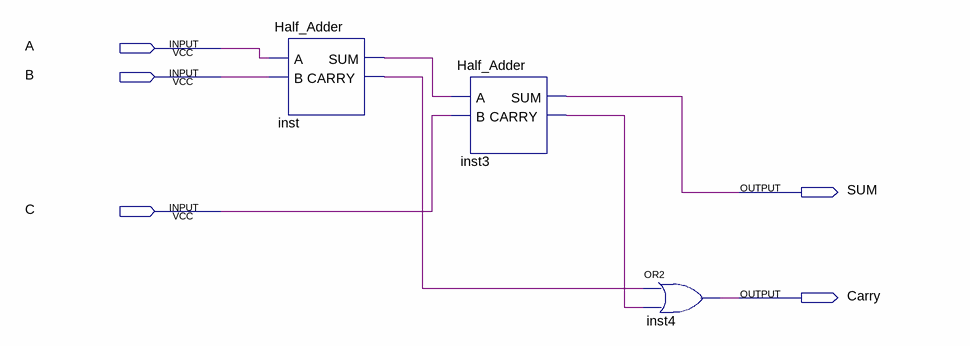
[diagram p0: schematic sheet]
// Quartus schematic Full_Adder.bdf as structural Verilog: 3 symbols, 5 pins
module Full_Adder (
  input  A,
  input  B,
  input  C,
  output SUM,
  output Carry
);

  wire inst3_carry, inst_carry, inst_sum;

  Half_Adder inst (.A(A), .B(B), .SUM(inst_sum), .CARRY(inst_carry));
  Half_Adder inst3 (.A(inst_sum), .B(C), .SUM(SUM), .CARRY(inst3_carry));
  or inst4 (Carry, inst_carry, inst3_carry);
endmodule
